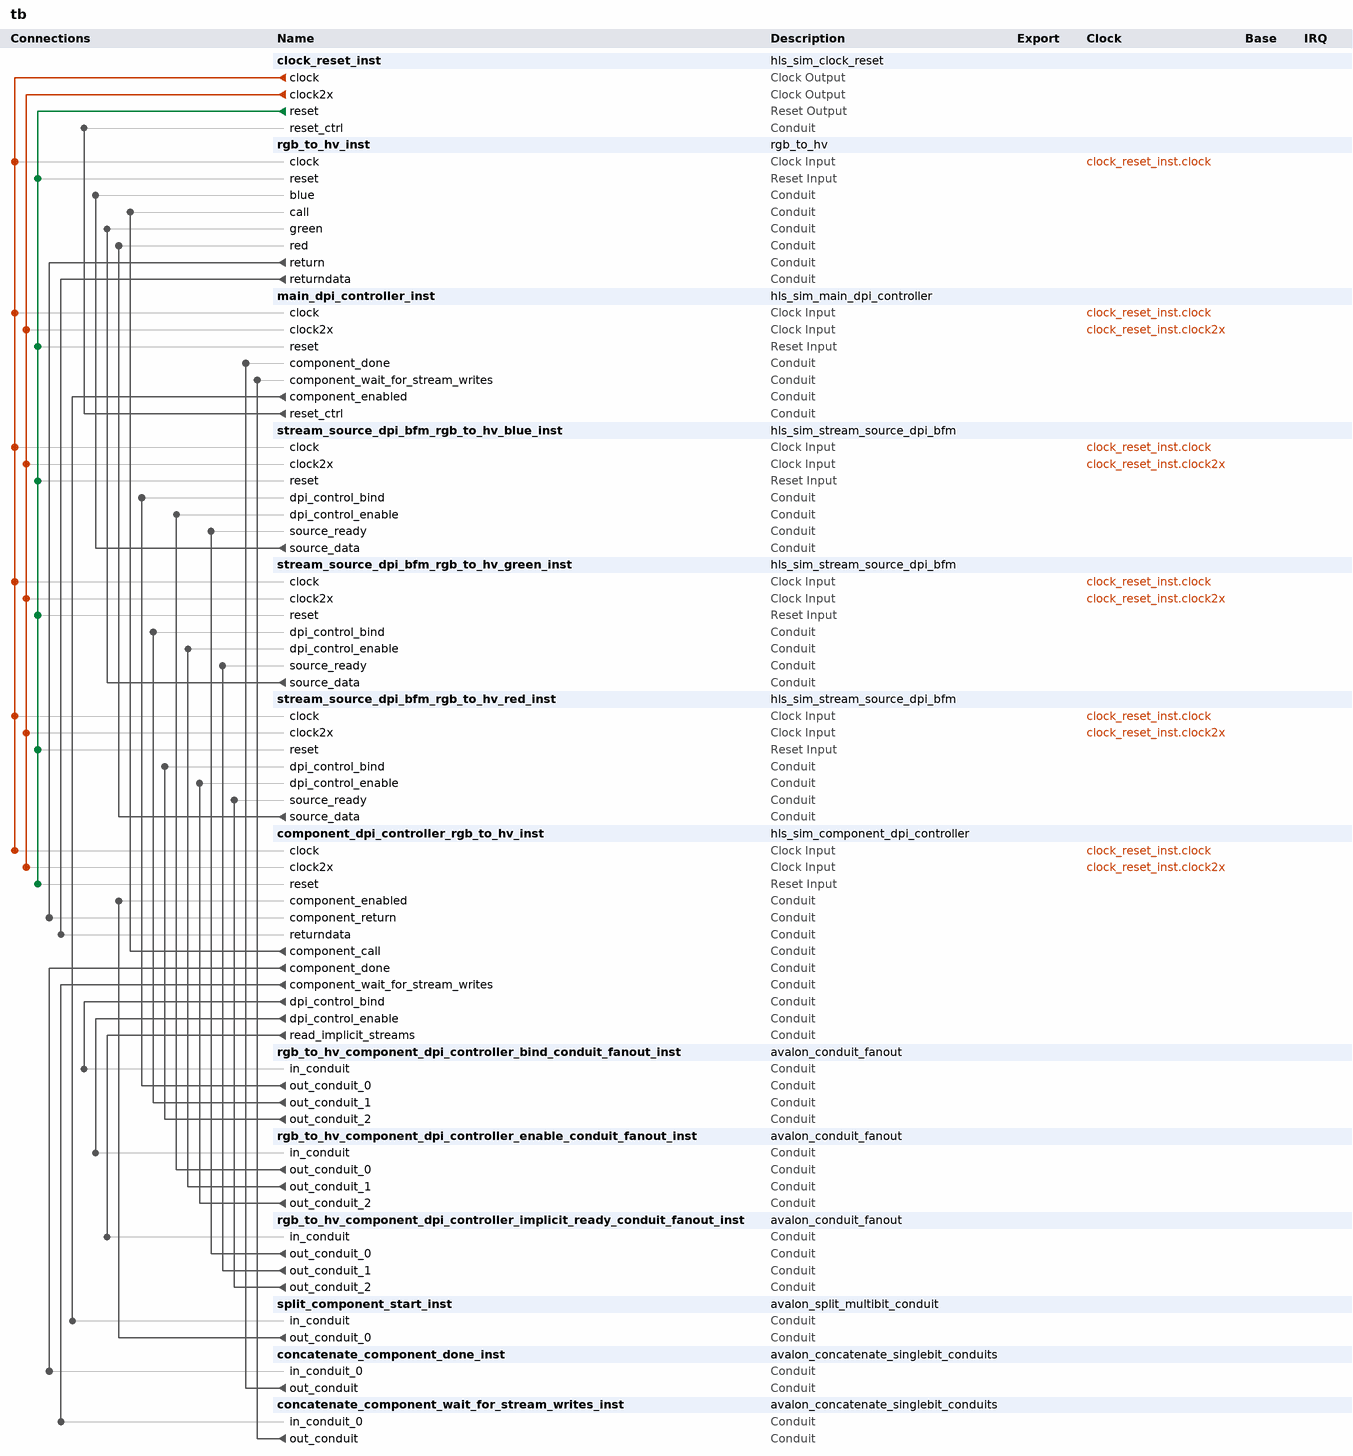
[diagram p0: system contents]
# Platform Designer (Qsys) system tb, MAX 10 10M08DAF256A7G
# Parameters at their usual value, and those the tool derives, are not listed.
package require qsys
create_system tb
set_project_property DEVICE_FAMILY {MAX 10}
set_project_property DEVICE 10M08DAF256A7G

add_instance clock_reset_inst hls_sim_clock_reset 1.0
set_instance_parameter_value clock_reset_inst RESET_CYCLE_HOLD 4

add_instance rgb_to_hv_inst rgb_to_hv 1.0

add_instance main_dpi_controller_inst hls_sim_main_dpi_controller 1.0
set_instance_parameter_value main_dpi_controller_inst COMPONENT_NAMES_STR rgb_to_hv
set_instance_parameter_value main_dpi_controller_inst NUM_COMPONENTS 1

add_instance stream_source_dpi_bfm_rgb_to_hv_blue_inst hls_sim_stream_source_dpi_bfm 1.0
set_instance_parameter_value stream_source_dpi_bfm_rgb_to_hv_blue_inst COMPONENT_NAME rgb_to_hv
set_instance_parameter_value stream_source_dpi_bfm_rgb_to_hv_blue_inst FORCE_STREAM_CONDUIT 1
set_instance_parameter_value stream_source_dpi_bfm_rgb_to_hv_blue_inst INTERFACE_NAME blue
set_instance_parameter_value stream_source_dpi_bfm_rgb_to_hv_blue_inst STREAM_BITSPERSYMBOL 1
set_instance_parameter_value stream_source_dpi_bfm_rgb_to_hv_blue_inst STREAM_DATAWIDTH 8
set_instance_parameter_value stream_source_dpi_bfm_rgb_to_hv_blue_inst USES_PACKETS 0

add_instance stream_source_dpi_bfm_rgb_to_hv_green_inst hls_sim_stream_source_dpi_bfm 1.0
set_instance_parameter_value stream_source_dpi_bfm_rgb_to_hv_green_inst COMPONENT_NAME rgb_to_hv
set_instance_parameter_value stream_source_dpi_bfm_rgb_to_hv_green_inst FORCE_STREAM_CONDUIT 1
set_instance_parameter_value stream_source_dpi_bfm_rgb_to_hv_green_inst INTERFACE_NAME green
set_instance_parameter_value stream_source_dpi_bfm_rgb_to_hv_green_inst STREAM_BITSPERSYMBOL 1
set_instance_parameter_value stream_source_dpi_bfm_rgb_to_hv_green_inst STREAM_DATAWIDTH 8
set_instance_parameter_value stream_source_dpi_bfm_rgb_to_hv_green_inst USES_PACKETS 0

add_instance stream_source_dpi_bfm_rgb_to_hv_red_inst hls_sim_stream_source_dpi_bfm 1.0
set_instance_parameter_value stream_source_dpi_bfm_rgb_to_hv_red_inst COMPONENT_NAME rgb_to_hv
set_instance_parameter_value stream_source_dpi_bfm_rgb_to_hv_red_inst FORCE_STREAM_CONDUIT 1
set_instance_parameter_value stream_source_dpi_bfm_rgb_to_hv_red_inst INTERFACE_NAME red
set_instance_parameter_value stream_source_dpi_bfm_rgb_to_hv_red_inst STREAM_BITSPERSYMBOL 1
set_instance_parameter_value stream_source_dpi_bfm_rgb_to_hv_red_inst STREAM_DATAWIDTH 8
set_instance_parameter_value stream_source_dpi_bfm_rgb_to_hv_red_inst USES_PACKETS 0

add_instance component_dpi_controller_rgb_to_hv_inst hls_sim_component_dpi_controller 1.0
set_instance_parameter_value component_dpi_controller_rgb_to_hv_inst COMPONENT_HAS_SLAVE_RETURN 0
set_instance_parameter_value component_dpi_controller_rgb_to_hv_inst COMPONENT_NAME rgb_to_hv
set_instance_parameter_value component_dpi_controller_rgb_to_hv_inst COMPONENT_NUM_OUTPUT_STREAMS 0
set_instance_parameter_value component_dpi_controller_rgb_to_hv_inst COMPONENT_NUM_SLAVES 0
set_instance_parameter_value component_dpi_controller_rgb_to_hv_inst RETURN_DATAWIDTH 27

add_instance rgb_to_hv_component_dpi_controller_bind_conduit_fanout_inst avalon_conduit_fanout 1.0
set_instance_parameter_value rgb_to_hv_component_dpi_controller_bind_conduit_fanout_inst numFanOut 3

add_instance rgb_to_hv_component_dpi_controller_enable_conduit_fanout_inst avalon_conduit_fanout 1.0
set_instance_parameter_value rgb_to_hv_component_dpi_controller_enable_conduit_fanout_inst numFanOut 3

add_instance rgb_to_hv_component_dpi_controller_implicit_ready_conduit_fanout_inst avalon_conduit_fanout 1.0
set_instance_parameter_value rgb_to_hv_component_dpi_controller_implicit_ready_conduit_fanout_inst numFanOut 3

add_instance split_component_start_inst avalon_split_multibit_conduit 1.0
set_instance_parameter_value split_component_start_inst multibit_width 1

add_instance concatenate_component_done_inst avalon_concatenate_singlebit_conduits 1.0
set_instance_parameter_value concatenate_component_done_inst multibit_width 1

add_instance concatenate_component_wait_for_stream_writes_inst avalon_concatenate_singlebit_conduits 1.0
set_instance_parameter_value concatenate_component_wait_for_stream_writes_inst multibit_width 1

# connections
add_connection clock_reset_inst.clock component_dpi_controller_rgb_to_hv_inst.clock clock
add_connection clock_reset_inst.clock main_dpi_controller_inst.clock clock
add_connection clock_reset_inst.clock rgb_to_hv_inst.clock clock
add_connection clock_reset_inst.clock stream_source_dpi_bfm_rgb_to_hv_blue_inst.clock clock
add_connection clock_reset_inst.clock stream_source_dpi_bfm_rgb_to_hv_green_inst.clock clock
add_connection clock_reset_inst.clock stream_source_dpi_bfm_rgb_to_hv_red_inst.clock clock
add_connection clock_reset_inst.clock2x component_dpi_controller_rgb_to_hv_inst.clock2x clock
add_connection clock_reset_inst.clock2x main_dpi_controller_inst.clock2x clock
add_connection clock_reset_inst.clock2x stream_source_dpi_bfm_rgb_to_hv_blue_inst.clock2x clock
add_connection clock_reset_inst.clock2x stream_source_dpi_bfm_rgb_to_hv_green_inst.clock2x clock
add_connection clock_reset_inst.clock2x stream_source_dpi_bfm_rgb_to_hv_red_inst.clock2x clock
add_connection clock_reset_inst.reset component_dpi_controller_rgb_to_hv_inst.reset reset
add_connection clock_reset_inst.reset main_dpi_controller_inst.reset reset
add_connection clock_reset_inst.reset rgb_to_hv_inst.reset reset
add_connection clock_reset_inst.reset stream_source_dpi_bfm_rgb_to_hv_blue_inst.reset reset
add_connection clock_reset_inst.reset stream_source_dpi_bfm_rgb_to_hv_green_inst.reset reset
add_connection clock_reset_inst.reset stream_source_dpi_bfm_rgb_to_hv_red_inst.reset reset
add_connection component_dpi_controller_rgb_to_hv_inst.component_call rgb_to_hv_inst.call conduit
add_connection component_dpi_controller_rgb_to_hv_inst.component_done concatenate_component_done_inst.in_conduit_0 conduit
add_connection component_dpi_controller_rgb_to_hv_inst.component_wait_for_stream_writes concatenate_component_wait_for_stream_writes_inst.in_conduit_0 conduit
add_connection component_dpi_controller_rgb_to_hv_inst.dpi_control_bind rgb_to_hv_component_dpi_controller_bind_conduit_fanout_inst.in_conduit conduit
add_connection component_dpi_controller_rgb_to_hv_inst.dpi_control_enable rgb_to_hv_component_dpi_controller_enable_conduit_fanout_inst.in_conduit conduit
add_connection component_dpi_controller_rgb_to_hv_inst.read_implicit_streams rgb_to_hv_component_dpi_controller_implicit_ready_conduit_fanout_inst.in_conduit conduit
add_connection concatenate_component_done_inst.out_conduit main_dpi_controller_inst.component_done conduit
add_connection concatenate_component_wait_for_stream_writes_inst.out_conduit main_dpi_controller_inst.component_wait_for_stream_writes conduit
add_connection main_dpi_controller_inst.component_enabled split_component_start_inst.in_conduit conduit
add_connection main_dpi_controller_inst.reset_ctrl clock_reset_inst.reset_ctrl conduit
add_connection rgb_to_hv_component_dpi_controller_bind_conduit_fanout_inst.out_conduit_0 stream_source_dpi_bfm_rgb_to_hv_blue_inst.dpi_control_bind conduit
add_connection rgb_to_hv_component_dpi_controller_bind_conduit_fanout_inst.out_conduit_1 stream_source_dpi_bfm_rgb_to_hv_green_inst.dpi_control_bind conduit
add_connection rgb_to_hv_component_dpi_controller_bind_conduit_fanout_inst.out_conduit_2 stream_source_dpi_bfm_rgb_to_hv_red_inst.dpi_control_bind conduit
add_connection rgb_to_hv_component_dpi_controller_enable_conduit_fanout_inst.out_conduit_0 stream_source_dpi_bfm_rgb_to_hv_blue_inst.dpi_control_enable conduit
add_connection rgb_to_hv_component_dpi_controller_enable_conduit_fanout_inst.out_conduit_1 stream_source_dpi_bfm_rgb_to_hv_green_inst.dpi_control_enable conduit
add_connection rgb_to_hv_component_dpi_controller_enable_conduit_fanout_inst.out_conduit_2 stream_source_dpi_bfm_rgb_to_hv_red_inst.dpi_control_enable conduit
add_connection rgb_to_hv_component_dpi_controller_implicit_ready_conduit_fanout_inst.out_conduit_0 stream_source_dpi_bfm_rgb_to_hv_blue_inst.source_ready conduit
add_connection rgb_to_hv_component_dpi_controller_implicit_ready_conduit_fanout_inst.out_conduit_1 stream_source_dpi_bfm_rgb_to_hv_green_inst.source_ready conduit
add_connection rgb_to_hv_component_dpi_controller_implicit_ready_conduit_fanout_inst.out_conduit_2 stream_source_dpi_bfm_rgb_to_hv_red_inst.source_ready conduit
add_connection rgb_to_hv_inst.return component_dpi_controller_rgb_to_hv_inst.component_return conduit
add_connection rgb_to_hv_inst.returndata component_dpi_controller_rgb_to_hv_inst.returndata conduit
add_connection split_component_start_inst.out_conduit_0 component_dpi_controller_rgb_to_hv_inst.component_enabled conduit
add_connection stream_source_dpi_bfm_rgb_to_hv_blue_inst.source_data rgb_to_hv_inst.blue conduit
add_connection stream_source_dpi_bfm_rgb_to_hv_green_inst.source_data rgb_to_hv_inst.green conduit
add_connection stream_source_dpi_bfm_rgb_to_hv_red_inst.source_data rgb_to_hv_inst.red conduit

set_interconnect_requirement {$system} qsys_mm.clockCrossingAdapter HANDSHAKE
set_interconnect_requirement {$system} qsys_mm.enableEccProtection FALSE
set_interconnect_requirement {$system} qsys_mm.insertDefaultSlave FALSE
set_interconnect_requirement {$system} qsys_mm.maxAdditionalLatency 1

save_system tb.qsys
